# Altium schematic sheet USB-C Protection.SchDoc
size A4; SheetNumber: 9; SheetTotal: 9
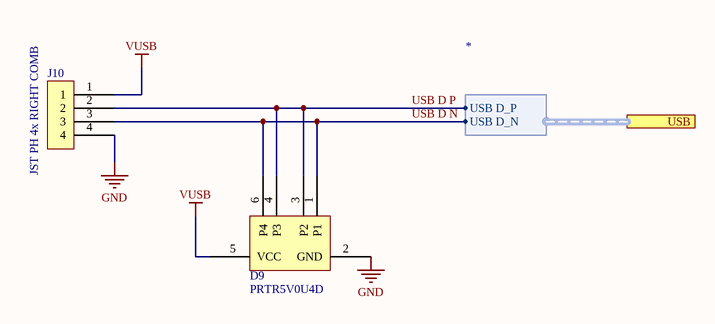
[diagram p0: USB-C Protection.SchDoc]

## Parts
D9  PRTR5V0U4D  [SC-47]
J10  JST PH 4x RIGHT COMB  [JST PH 4x RIGHT COMB]

## Ports
USB (harness *)

## Harnesses
*: USB D_P, USB D_N

## Nets
GND: D9.2(GND) J10.4
VUSB: D9.5(VCC) J10.1
USB D N: D9.1(P1) D9.6(P4) J10.3 ; port USB.USB D_N
USB D P: D9.3(P2) D9.4(P3) J10.2 ; port USB.USB D_P

## Library data of the parts
D9 = PRTR5V0U4D: Clamp Ipp Tvs Diode Surface Mount 6-TSOP